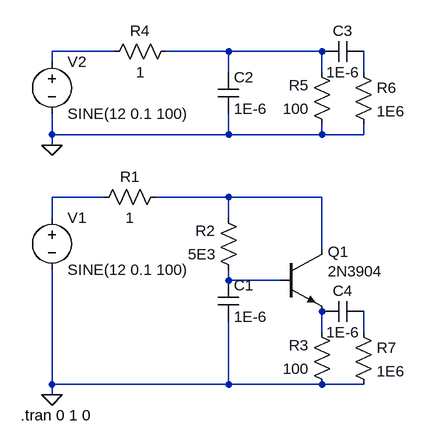
[diagram p0: schematic capmult.asc]
capmult.asc, the LTspice schematic file:
Version 4
SHEET 1 880 680
WIRE 144 -96 48 -96
WIRE 320 -96 224 -96
WIRE 464 -96 320 -96
WIRE 48 -80 48 -96
WIRE 320 -64 320 -96
WIRE 464 -64 464 -96
WIRE 528 -64 528 -96
WIRE 48 32 48 0
WIRE 320 32 320 0
WIRE 320 32 48 32
WIRE 464 32 464 16
WIRE 464 32 320 32
WIRE 528 32 528 16
WIRE 528 32 464 32
WIRE 48 48 48 32
WIRE 128 128 48 128
WIRE 320 128 208 128
WIRE 464 128 320 128
WIRE 48 160 48 128
WIRE 320 160 320 128
WIRE 464 208 464 128
WIRE 320 256 320 240
WIRE 400 256 320 256
WIRE 464 336 464 304
WIRE 528 336 528 304
WIRE 48 416 48 240
WIRE 320 416 320 320
WIRE 320 416 48 416
WIRE 464 416 320 416
WIRE 528 416 464 416
WIRE 48 432 48 416
FLAG 48 48 0
FLAG 48 432 0
SYMBOL voltage 48 144 R0
WINDOW 123 0 0 Left 2
WINDOW 39 0 0 Left 2
SYMATTR InstName V1
SYMATTR Value SINE(12 0.1 100)
SYMBOL res 224 112 R90
WINDOW 0 0 56 VBottom 2
WINDOW 3 32 56 VTop 2
SYMATTR InstName R1
SYMATTR Value 1
SYMBOL res 336 256 R180
WINDOW 0 36 76 Left 2
WINDOW 3 36 40 Left 2
SYMATTR InstName R2
SYMATTR Value 5E3
SYMBOL res 480 432 R180
WINDOW 0 36 76 Left 2
WINDOW 3 36 40 Left 2
SYMATTR InstName R3
SYMATTR Value 100
SYMBOL cap 304 256 R0
SYMATTR InstName C1
SYMATTR Value 1E-6
SYMBOL npn 400 208 R0
WINDOW 0 73 4 Left 2
WINDOW 3 73 34 Left 2
SYMATTR InstName Q1
SYMATTR Value 2N3904
SYMBOL voltage 48 -96 R0
WINDOW 123 0 0 Left 2
WINDOW 39 0 0 Left 2
SYMATTR InstName V2
SYMATTR Value SINE(12 0.1 100)
SYMBOL res 240 -112 R90
WINDOW 0 0 56 VBottom 2
WINDOW 3 32 56 VTop 2
SYMATTR InstName R4
SYMATTR Value 1
SYMBOL res 480 32 R180
WINDOW 0 36 76 Left 2
WINDOW 3 36 40 Left 2
SYMATTR InstName R5
SYMATTR Value 100
SYMBOL cap 304 -64 R0
SYMATTR InstName C2
SYMATTR Value 1E-6
SYMBOL cap 528 -112 R90
WINDOW 0 0 32 VBottom 2
WINDOW 3 32 32 VTop 2
SYMATTR InstName C3
SYMATTR Value 1E-6
SYMBOL cap 528 288 R90
WINDOW 0 0 32 VBottom 2
WINDOW 3 32 32 VTop 2
SYMATTR InstName C4
SYMATTR Value 1E-6
SYMBOL res 512 -80 R0
SYMATTR InstName R6
SYMATTR Value 1E6
SYMBOL res 512 320 R0
SYMATTR InstName R7
SYMATTR Value 1E6
TEXT 0 464 Left 2 !.tran 0 1 0

The netlist it stands for:
* capmult.asc
V1 N004 0 SINE(12 0.1 100)
R1 N005 N004 1
R2 N006 N005 5E3
R3 0 N007 100
C1 N006 0 1E-6
Q1 N005 N006 N007 0 2N3904
V2 N001 0 SINE(12 0.1 100)
R4 N002 N001 1
R5 0 N002 100
C2 N002 0 1E-6
C3 N003 N002 1E-6
C4 N008 N007 1E-6
R6 N003 0 1E6
R7 N008 0 1E6
.model NPN NPN
.model PNP PNP
.lib standard.bjt
.tran 0 1 0
.backanno
.end